# Altium schematic sheet ADS7952-Q1.SchDoc
size A4
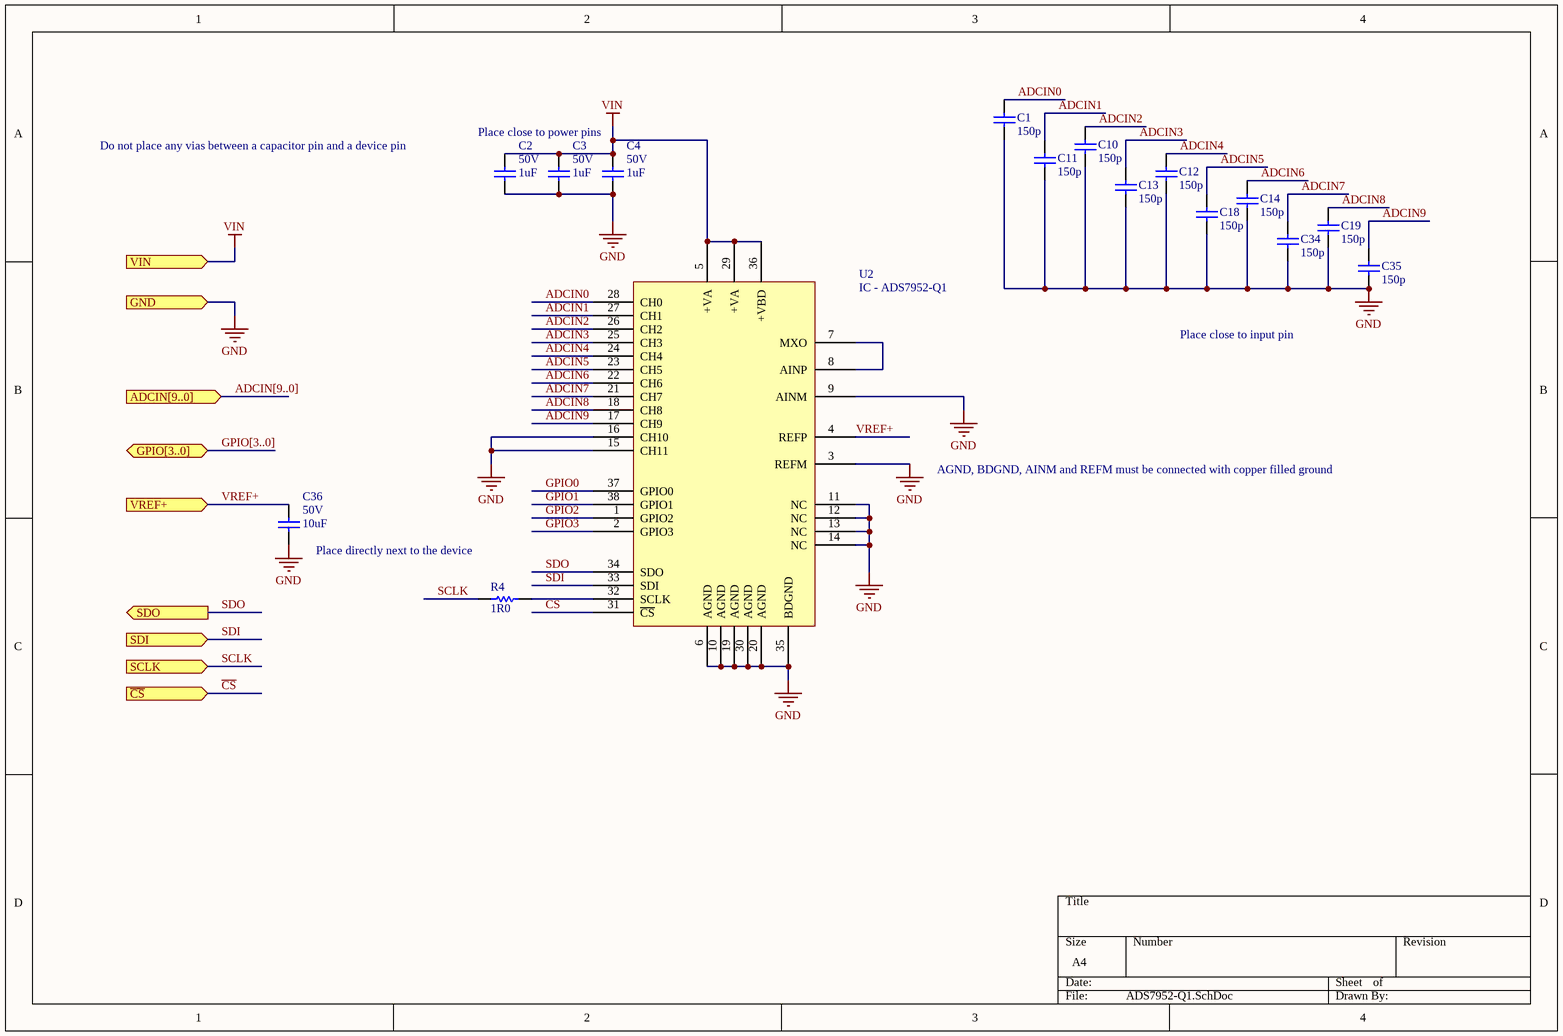
[diagram p0: ADS7952-Q1.SchDoc]

## Parts
C1  value 150p  [CS-0603]  (hidden comment: CS - CAPACITOR)
C2  value 1uF  VOLTAGE: 50V  [CS-0603]  (hidden comment: CS - CAPACITOR)
C3  value 1uF  VOLTAGE: 50V  [CS-0603]  (hidden comment: CS - CAPACITOR)
C4  value 1uF  VOLTAGE: 50V  [CS-0603]  (hidden comment: CS - CAPACITOR)
C10  value 150p  [CS-0603]  (hidden comment: CS - CAPACITOR)
C11  value 150p  [CS-0603]  (hidden comment: CS - CAPACITOR)
C12  value 150p  [CS-0603]  (hidden comment: CS - CAPACITOR)
C13  value 150p  [CS-0603]  (hidden comment: CS - CAPACITOR)
C14  value 150p  [CS-0603]  (hidden comment: CS - CAPACITOR)
C18  value 150p  [CS-0603]  (hidden comment: CS - CAPACITOR)
C19  value 150p  [CS-0603]  (hidden comment: CS - CAPACITOR)
C34  value 150p  [CS-0603]  (hidden comment: CS - CAPACITOR)
C35  value 150p  [CS-0603]  (hidden comment: CS - CAPACITOR)
C36  value 10uF  VOLTAGE: 50V  [CS-0603]  (hidden comment: CS - CAPACITOR)
R4  value 1R0  [RS-0603]  (hidden comment: RS - RESISTOR)
U2  IC - ADS7952-Q1  [IC-TSSOP-38]

## Ports
ADCIN[9..0] (in), GND (in), GPIO[3..0] (bidir), SCLK (in), SDI (in), SDO (out), VIN (in), VREF+ (in), ~{CS} (in)

## Nets
GND: C1.1 C2.1 C3.1 C4.1 C10.1 C11.1 C12.1 C13.1 C14.1 C18.1 C19.1 C34.1 C35.1 C36.1 U2.3(REFM) U2.6(AGND) U2.9(AINM) U2.10(AGND) U2.11(NC) U2.12(NC) U2.13(NC) U2.14(NC) U2.15(CH11) U2.16(CH10) U2.19(AGND) U2.20(AGND) U2.30(AGND) U2.35(BDGND) ; port GND
VIN: C2.2 C3.2 C4.2 U2.5(+VA) U2.29(+VA) U2.36(+VBD) ; port VIN
ADCIN0: C1.2 U2.28(CH0)
ADCIN1: C11.2 U2.27(CH1)
ADCIN2: C10.2 U2.26(CH2)
ADCIN3: C13.2 U2.25(CH3)
ADCIN4: C12.2 U2.24(CH4)
ADCIN5: C18.2 U2.23(CH5)
ADCIN6: C14.2 U2.22(CH6)
ADCIN7: C34.2 U2.21(CH7)
ADCIN8: C19.2 U2.18(CH8)
ADCIN9: C35.2 U2.17(CH9)
~{CS}: U2.31(~{CS}) ; port ~{CS}
GPIO0: U2.37(GPIO0)
GPIO1: U2.38(GPIO1)
GPIO2: U2.1(GPIO2)
GPIO3: U2.2(GPIO3)
SCLK: R4.2 ; port SCLK
SDI: U2.33(SDI) ; port SDI
SDO: U2.34(SDO) ; port SDO
VREF+: C36.2 U2.4(REFP) ; port VREF+
NetR4_1: R4.1 U2.32(SCLK)
NetU2_7: U2.7(MXO) U2.8(AINP)

## Buses and harness runs
bus ADCIN[9..0] = port ADCIN[9..0]
bus GPIO[3..0] = port GPIO[3..0]

## Notes on the sheet
- (near C2) Do not place any vias between a capacitor pin and a device pin
- Place close to power pins
- Place close to input pin
- AGND, BDGND, AINM and REFM must be connected with copper filled ground
- Place directly next to the device

## Library data of the parts
C1 C10-C14 C18 C19 C34 C35 = CS - CAPACITOR: TOLERANCE: 10%; VOLTAGE: 16V; Supplier 1: *; Supplier Part Number 1: *; (FIELD A): *; (FLIED C): *; (FIELD B): *; Manufacturer: *
C2-C4 C36 = CS - CAPACITOR: TOLERANCE: 10%; Supplier 1: *; Supplier Part Number 1: *; (FIELD A): *; (FLIED C): *; (FIELD B): *; Manufacturer: *
R4 = RS - RESISTOR: TOLERANCE: RES TOL; POWER: RES POWER; Supplier Part Number 1: *; Supplier 1: *; (FIELD A): *; (FLIED C): *; (FIELD B): *; Manufacturer: *
U2 = IC - ADS7952-Q1: ADC 12 bits 12 channels MUX SPI